# Altium schematic sheet ZHSD-ZYNQ-CONFIG.SchDoc
size A4; DocumentNumber: 4; SheetNumber: 4; SheetTotal: 17; Size: A4
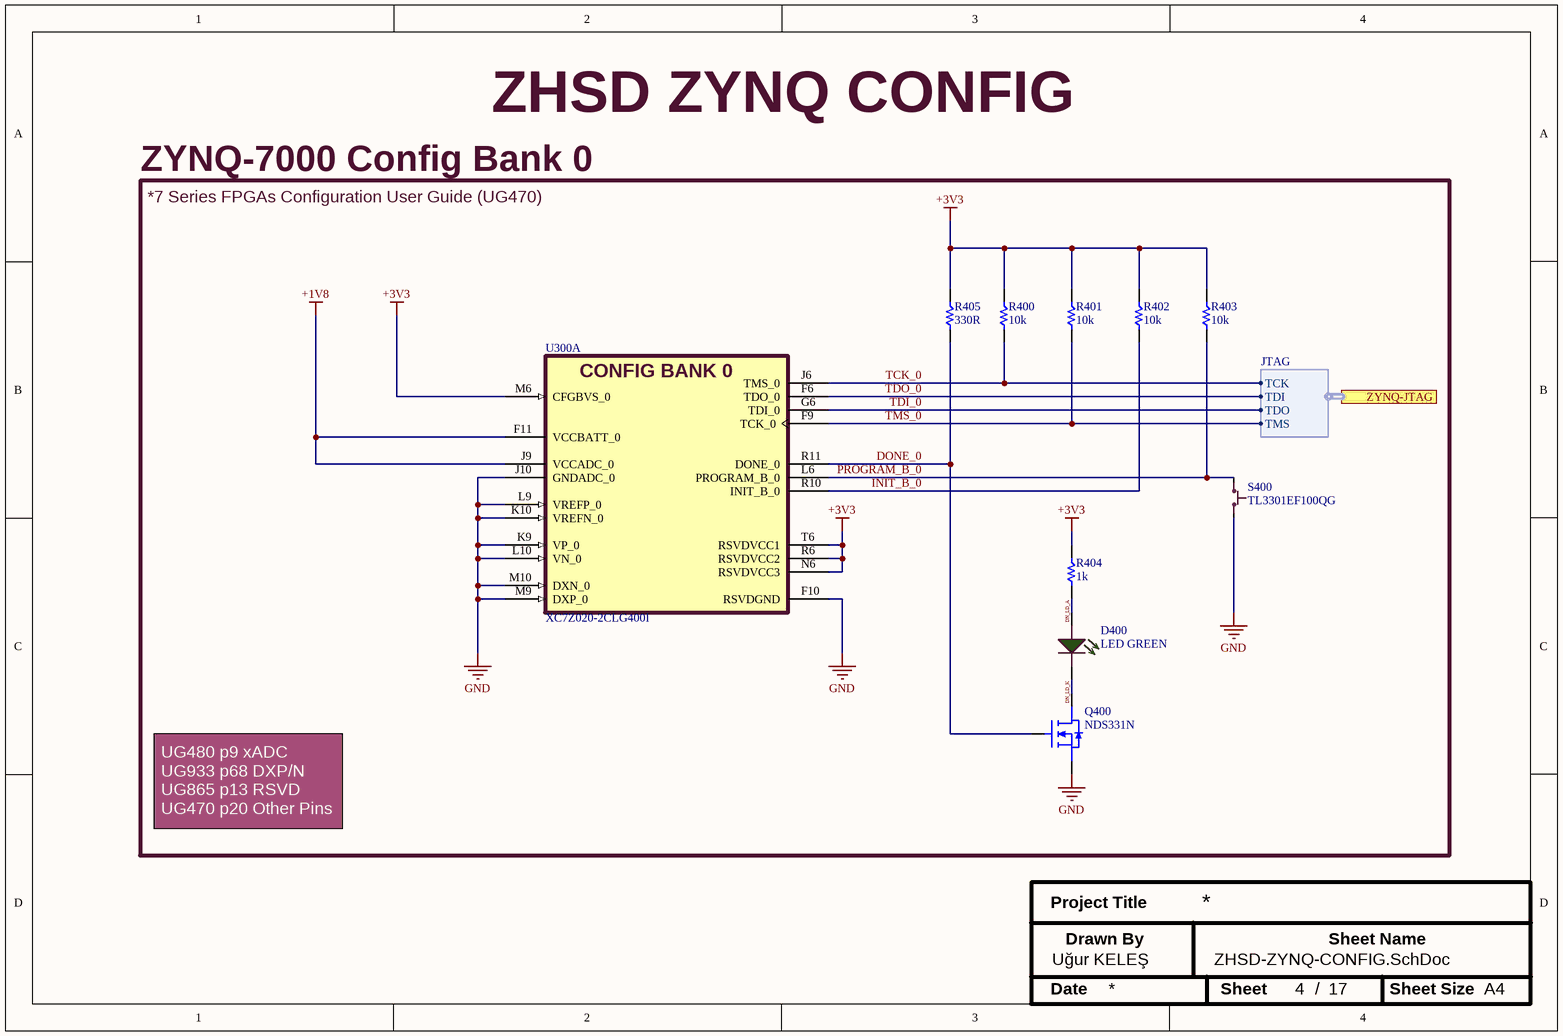
[diagram p0: ZHSD-ZYNQ-CONFIG.SchDoc]

## Parts
D400  LED GREEN  [0603_LED_1608N]
Q400  NDS331N  [SOT95P251X112-3N]
R400  10k  [0603RESC1608X05N]
R401  10k  [0603RESC1608X05N]
R402  10k  [0603RESC1608X05N]
R403  10k  [0603RESC1608X05N]
R404  1k  [0402RESC1005X04N]
R405  330R  [0603RESC1608X05N]
S400  TL3301EF100QG  [TL3301_Tact_SW]
U300  XC7Z020-2CLG400I  [BGA400C80P20X20_1700X1700X147]  (part A of 8)

## Ports
ZYNQ-JTAG (harness JTAG, see ZHSD-Block[4400,5700], ZHSD-JTAG[9300,4400])

## Harnesses
JTAG: TCK, TDI, TDO, TMS

## Nets
+1V8: U300.F11(VCCBATT_0) U300.J9(VCCADC_0)
+3V3: R400.2 R401.2 R402.2 R403.2 R404.2 R405.2 U300.M6(CFGBVS_0) U300.N6(RSVDVCC3) U300.R6(RSVDVCC2) U300.T6(RSVDVCC1)
GND: Q400.2(S) S400.1,2 U300.F10(RSVDGND) U300.J10(GNDADC_0) U300.K9(VP_0) U300.K10(VREFN_0) U300.L9(VREFP_0) U300.L10(VN_0) U300.M9(DXP_0) U300.M10(DXN_0)
DN_LD_A: D400.1(A) R404.1
DN_LD_K: D400.2(C) Q400.3(D)
DONE_0: Q400.1(G) R405.1 U300.R11(DONE_0)
INIT_B_0: R402.1 U300.R10(INIT_B_0)
PROGRAM_B_0: R403.1 S400.3,4 U300.L6(PROGRAM_B_0)
TCK_0: R400.1 U300.J6(TMS_0) ; port ZYNQ-JTAG.TCK
TDI_0: U300.G6(TDI_0) ; port ZYNQ-JTAG.TDO
TDO_0: U300.F6(TDO_0) ; port ZYNQ-JTAG.TDI
TMS_0: R401.1 U300.F9(TCK_0) ; port ZYNQ-JTAG.TMS

## Notes on the sheet
- ZYNQ-7000 Config Bank 0
- ZHSD ZYNQ CONFIG
- *7 Series FPGAs Configuration User Guide (UG470)
- UG480 p9 xADC
  UG933 p68 DXP/N
  UG865 p13 RSVD
  UG470 p20 Other Pins
- Project Title
- Uğur KELEŞ
- Drawn By
- Sheet Name
- Date
- Sheet
- /
- Sheet Size
- A4
- (in symbol XC7Z020-2CLG400I, part A) CONFIG BANK 0

## Library data of the parts
D400 = LTST-C191TGKT: LED GREEN CLEAR CHIP SMD; Manufacturer: Lite-On Inc.; ComponentLink1Description: Datasheet; ComponentLink1URL: https://optoelectronics.liteon.com/upload/download/DS22-2000-300/LTST-C191TGKT.PDF; MPN: LTST-C191TGKT; Package: 0603
Q400 = NDS331N: N-Channel 20 V 1.3A (Ta) 500mW (Ta) Surface Mount SOT-23-3; Manufacturer: onsemi; Drain to Source Voltage (Vdss): 20 V; Rds On (Max) @ Id, Vgs: 160mOhm @ 1.5A, 4.5V; Vgs (Max): ±8V; ComponentLink1Description: Datasheet; ComponentLink1URL: https://www.onsemi.com/pdf/datasheet/nds331n-d.pdf; MPN: NDS331N; Package: SOT-23-3
R400-R403 = RC0603FR-0710KL: RES 10K OHM 1% 1/10W 0603(1608); Manufacturer: YAGEO; Value: 10 kOhms; Voltage: 75V; ComponentLink1Description: Datasheet; ComponentLink1URL: https://yageogroup.com/content/datasheet/asset/file/PYU-RC_GROUP_51_ROHS_L; MPN: RC0603FR-0710KL; Tolerance: ±1%; Package: 0603
R404 = RC0402JR-071KL: RES 1K OHM 5% 1/16W 0402 (1005); Manufacturer: YAGEO; Value: 1 kOhms; Voltage: 50V; ComponentLink1Description: Datasheet; ComponentLink1URL: https://yageogroup.com/content/datasheet/asset/file/PYU-RT_1-TO-0-01_ROHS_L; MPN: RC0402JR-071KL; Tolerance: ±5%; Package: 0402
R405 = RC0603FR-07330RL: RES 330 OHM 1% 1/10W 0603(1608); Manufacturer: YAGEO; Value: 330 Ohms; Voltage: 75V; ComponentLink1Description: Datasheet; ComponentLink1URL: https://yageogroup.com/content/datasheet/asset/file/PYU-RC_GROUP_51_ROHS_L; MPN: RC0603FR-07330RL; Tolerance: ±1%; Package: 0603
S400 = TL3301EF100QG: SWITCH TACTILE SPST-NO 0.05A 12V; pin to pad: 1,2>1+2 3,4>3+4; Manufacturer: E-Switch; ComponentLink1Description: Datasheet; ComponentLink1URL: https://configured-product-images.s3.amazonaws.com/Datasheets/TL3301.pdf; MPN: TL3301EF100QG
U300 = XC7Z020-2CLG400I: Dual ARM® Cortex®-A9 MPCore™ with CoreSight™ System On Chip (SOC) IC Zynq®-7000 Artix™-7 FPGA, 85K Logic Cells 766MHz 400-CSPBGA (17x17); Manufacturer: AMD/XILINX; MPN: XC7Z020-2CLG400I; ComponentLink1Description: Datasheet; ComponentLink1URL: https://docs.amd.com/v/u/en-US/ds190-Zynq-7000-Overview; ComponentLink2Description: DC and AC Switching Characteristics; ComponentLink2URL: https://docs.amd.com/v/u/en-US/ds187-XC7Z010-XC7Z020-Data-Sheet; ComponentLink3Description: PCB Design Guide; ComponentLink3URL: https://docs.amd.com/v/u/en-US/ug933-Zynq-7000-PCB; ComponentLink4Description: Packaging and Pinout; ComponentLink4URL: https://docs.amd.com/v/u/en-US/ug865-Zynq-7000-Pkg-Pinout; ComponentLink5Description: Zynq 7000 SoC Technical Reference Manual; ComponentLink5URL: https://docs.amd.com/r/en-US/ug585-zynq-7000-SoC-TRM